# EAGLE design HOST (EAGLE 6.3)
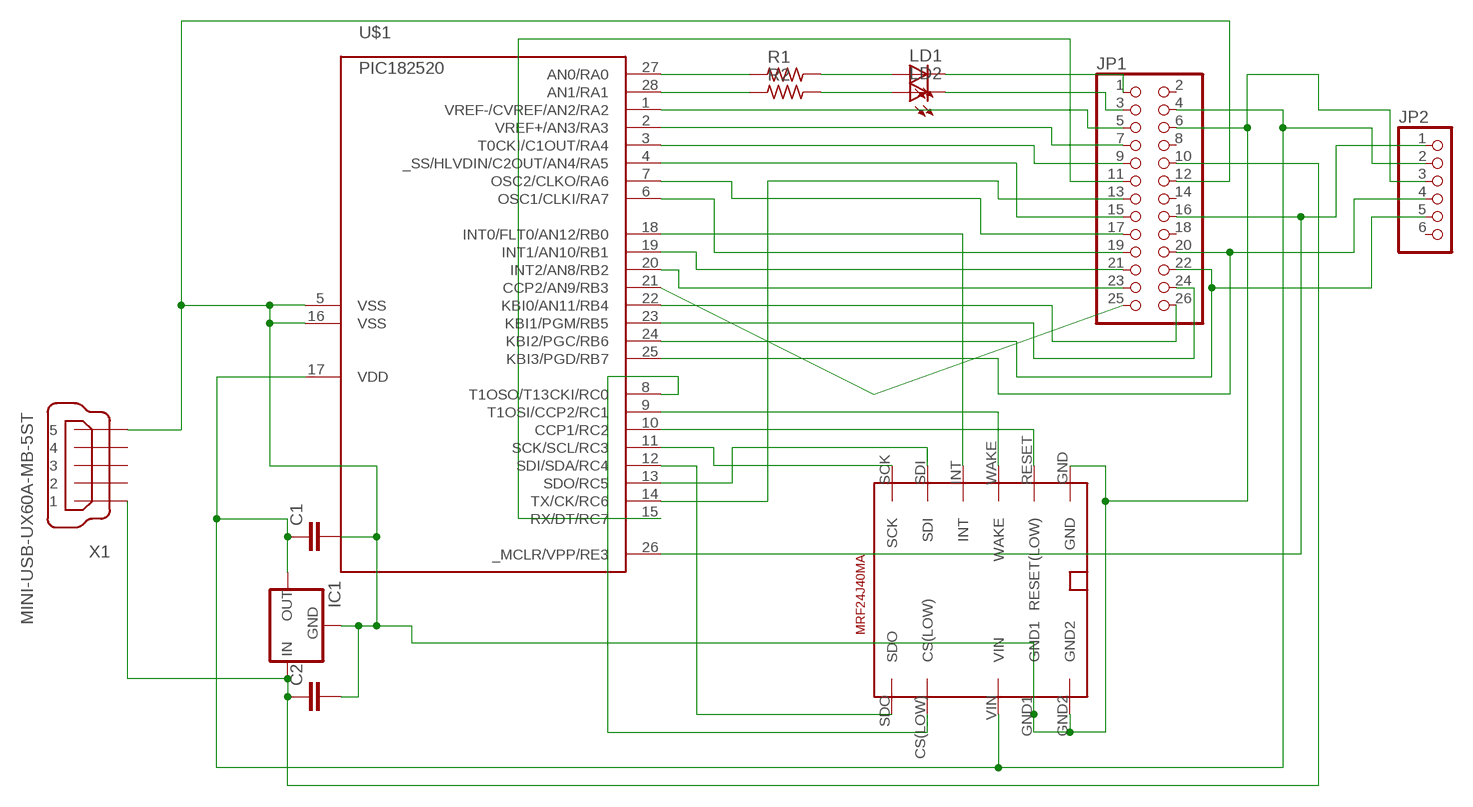
[diagram p0: schematic, sheet 1]

## Parts
C1  C-EUC0805  [C0805]
C2  C-EUC0805  [C0805]
IC1  78LXX-SOT89  [SOT89]
JP1  PINHD-2X13_2.54  [2X13]
JP2  PINHD-1X6  [1X06]
LD1  LEDCHIPLED_0805  [CHIPLED_0805]
LD2  LEDCHIPLED_0805  [CHIPLED_0805]
R1  R_0805  [R0805]
R2  R_0805  [R0805]
U$1  PIC182520  [QFN28]
U$2  MRF24J40MA  [MRF24J40MA]
X1  MINI-USB-UX60A-MB-5ST  [UX60A-MB-5ST]

## Nets
N$1: U$1.12(SDI/SDA/RC4) U$2.SDO
N$2: U$1.8(T1OSO/T13CKI/RC0) U$2.CS(LOW)
N$3: U$1.10(CCP1/RC2) U$2.RESET(RESET(LOW))
N$4: U$1.11(SCK/SCL/RC3) U$2.SCK
N$5: U$1.13(SDO/RC5) U$2.SDI
N$6: U$1.18(INT0/FLT0/AN12/RB0) U$2.INT
N$7: U$1.9(T1OSI/CCP2/RC1) U$2.WAKE
N$9: JP1.13 U$1.14(TX/CK/RC6)
N$10: C1.2 C2.2 IC1.1(GND) JP1.6 JP1.12 JP2.3 U$1.5(VSS) U$1.16(VSS) U$2.GND U$2.GND1 U$2.GND2 X1.5
N$11: JP1.11 U$1.15(RX/DT/RC7)
N$12: C2.1 IC1.2(IN) JP1.10 X1.1
N$14: R1.1 U$1.27(AN0/RA0)
N$15: R2.1 U$1.28(AN1/RA1)
N$16: LD2.A R2.2
N$17: LD1.A R1.2
N$18: JP1.1 LD1.C
N$19: JP1.3 LD2.C
N$20: JP1.5 U$1.1(VREF-/CVREF/AN2/RA2)
N$21: JP1.7 U$1.2(VREF+/AN3/RA3)
N$22: JP1.9 U$1.3(T0CKI/C1OUT/RA4)
N$24: JP1.21 U$1.19(INT1/AN10/RB1)
N$25: JP1.19 U$1.6(OSC1/CLKI/RA7)
N$26: JP1.15 U$1.4(_SS/HLVDIN/C2OUT/AN4/RA5)
N$27: JP1.17 U$1.7(OSC2/CLKO/RA6)
N$28: JP1.23 U$1.20(INT2/AN8/RB2)
N$29: JP1.25 U$1.21(CCP2/AN9/RB3)
N$30: JP1.26 U$1.22(KBI0/AN11/RB4)
N$31: JP1.24 U$1.23(KBI1/PGM/RB5)
N$32: JP1.22 JP2.5 U$1.24(KBI2/PGC/RB6)
N$33: JP1.20 JP2.4 U$1.25(KBI3/PGD/RB7)
N$35: JP1.16 JP2.1 U$1.26(_MCLR/VPP/RE3)
N$36: C1.1 IC1.3(OUT) JP1.4 JP2.2 U$1.17(VDD) U$2.VIN
Unconnected: JP1.2 JP1.8 JP1.14 JP1.18 JP2.6 X1.2 X1.3 X1.4

## Library data of the parts
C1 C2 = rcl 2:C-EU: CAPACITOR, European symbol
IC1 = v-reg-3:78LXX: VOLTAGE REGULATOR
JP1 = pinhead-1:PINHD-2X13: PIN HEADER
JP2 = pinhead 2:PINHD-1X6: PIN HEADER
LD1 LD2 = led 2:LED: LED OSRAM: - CHIPLED LG R971, LG N971, LY N971, LG Q971, LY Q971, LO R971, LY R971 LH N974, LH R974 LS Q976, LO Q976, LY Q976 LO Q996 - Hyper CHIPLED LW Q18S LB Q993, LB Q99A, LB R99A - SideLED LS A670, LO A670, LY A670, LG A670, LP A670 LB A673, LV A673, LT A673, LW A673 LH A674 LY A675 LS A676, LA A676, LO A676, LY A676, LW A676 LS A679, LY A679, LG A679 - Hyper Micro SIDELED® LS Y876, LA Y876, LO Y876, LY Y876 LT Y87S - SmartLED LW L88C, LW L88S LB L89C, LB L89S, LG L890 LS L89K, LO L89K, LY L89K LS L896, LA L896, LO L896, LY L896 - TOPLED LS T670, LO T670, LY T670, LG T670, LP T670 LSG T670, LSP T670, LSY T670, LOP T670, LYG T670 LG T671, LOG T671, LSG T671 LB T673, LV T673, LT T673, LW T673 LH T674 LS T676, LA T676, LO T676, LY T676, LB T676, LH T676, LSB T676, LW T676 LB T67C, LV T67C, LT T67C, LS T67K, LO T67K, LY T67K, LW E67C LS E67B, LA E67B, LO E67B, LY E67B, LB E67C, LV E67C, LT E67C LW T67C LS T679, LY T679, LG T679 LS T770, LO T770, LY T770, LG T770, LP T770 LB T773, LV T773, LT T773, LW T773 LH T774 LS E675, LA E675, LY E675, LS T675 LS T776, LA T776, LO T776, LY T776, LB T776 LHGB T686 LT T68C, LB T68C - Hyper Mini TOPLED® LB M676 - Mini TOPLED Santana® LG M470 LS M47K, LO M47K, LY M47K Source: http://www.osram.convergy.de/
R1 R2 = rc-master:R_: RESISTOR
U$1 = pic18fxx20-2:PIC18*2520: PIC18*2520 Microchip FLASH Microcontroller with A/D DEVICE FEATURES Feature PIC18*2520 Program Memory (bytes) 32768 Program Memory (instructions) 16384 Interupt Sources 19 I/O Ports Ports A, B, C, (E) Capture/Compare/PWM Modules 2 Enhanced Capture/Compare/PWM Modules 0 Parallel Communications (PSP) No 10-bit Analog-to-Digital Module 10 input Channels Package Types 28-pin PDIP 28-pin SOIC 28-pin QFN NOTES: F only after 18, means standard voltage range from 4.2v to 5.5v LF after 18, means extended voltage range from 2.0v to 5.5v -E before / denotes extended temperature range from -40°C to +120°C -I before / denotes industrial temperature range from -40°C to +85°C /PT suffix denotes TQFP package /SO suffix denotes SOIC package /SP suffix denotes Skinny Plastic DIP package /P suffix denotes Plastic DIP package /ML suffix denotes QFN package
U$2 = MRF24J40MA:MRF24J40MA
X1 = con-hirose 2:MINI-USB-: MINI USB Connector Source: http://www.hirose.co.jp/cataloge_hp/e24000019.pdf

## Board
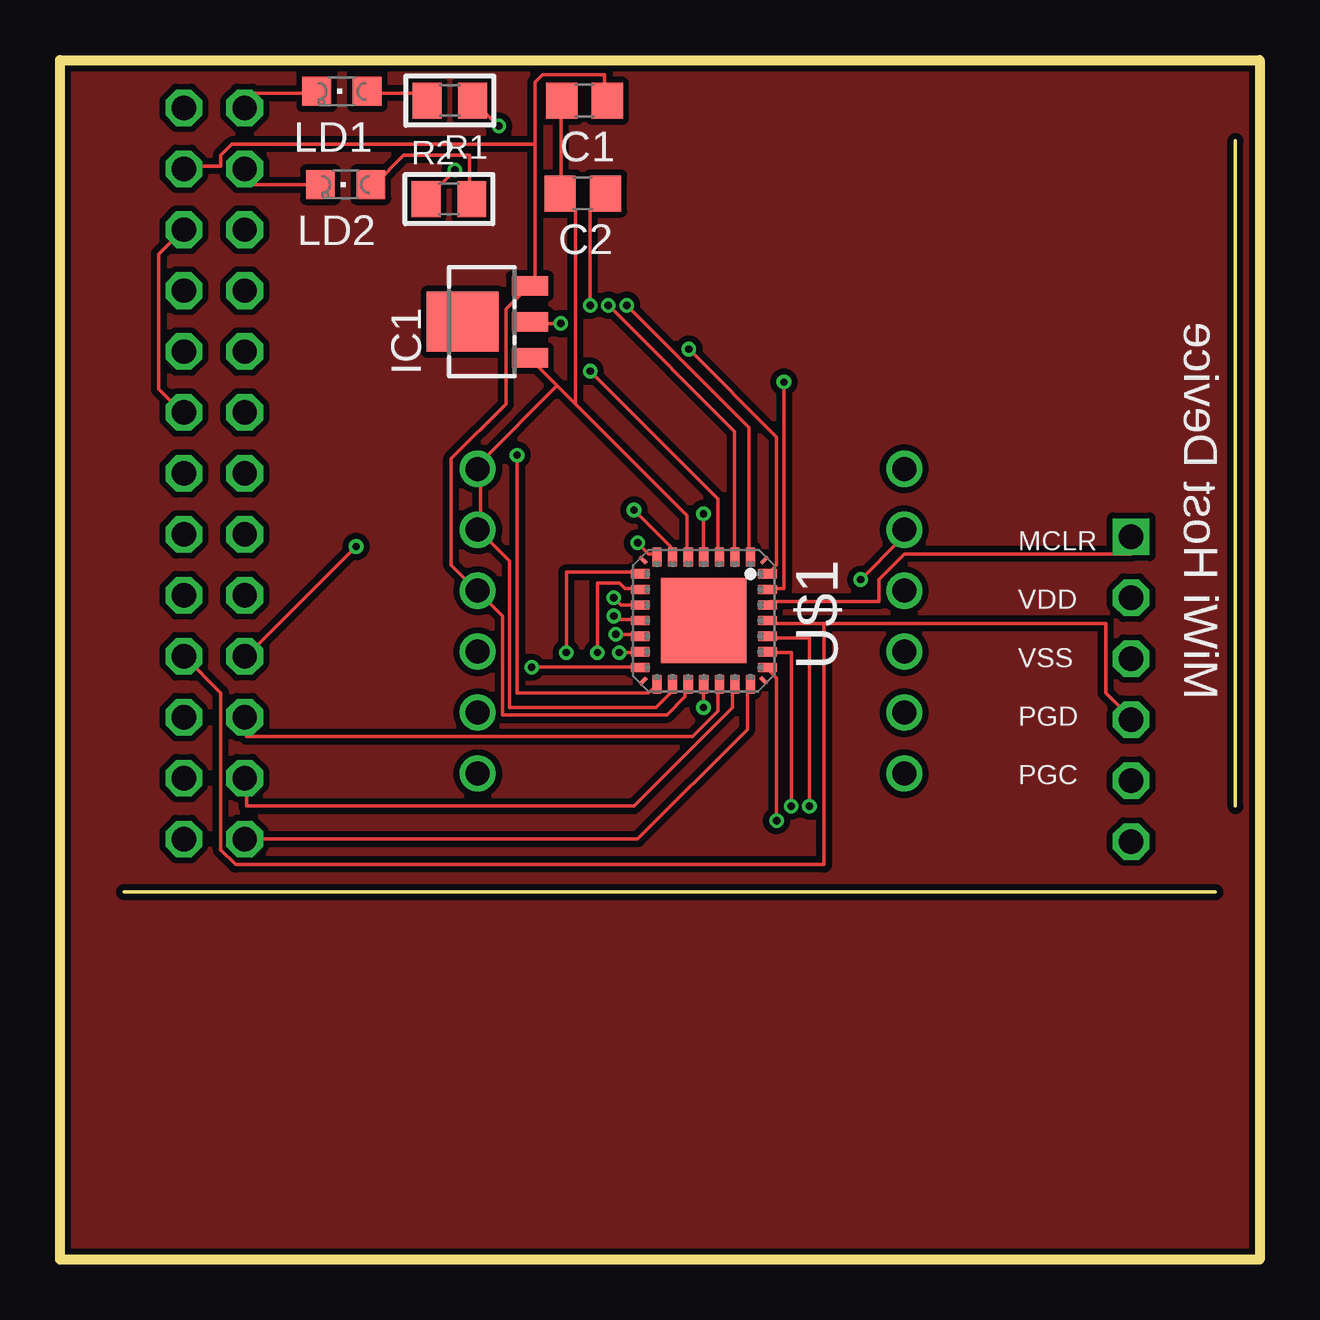
[diagram p1: board, top side]
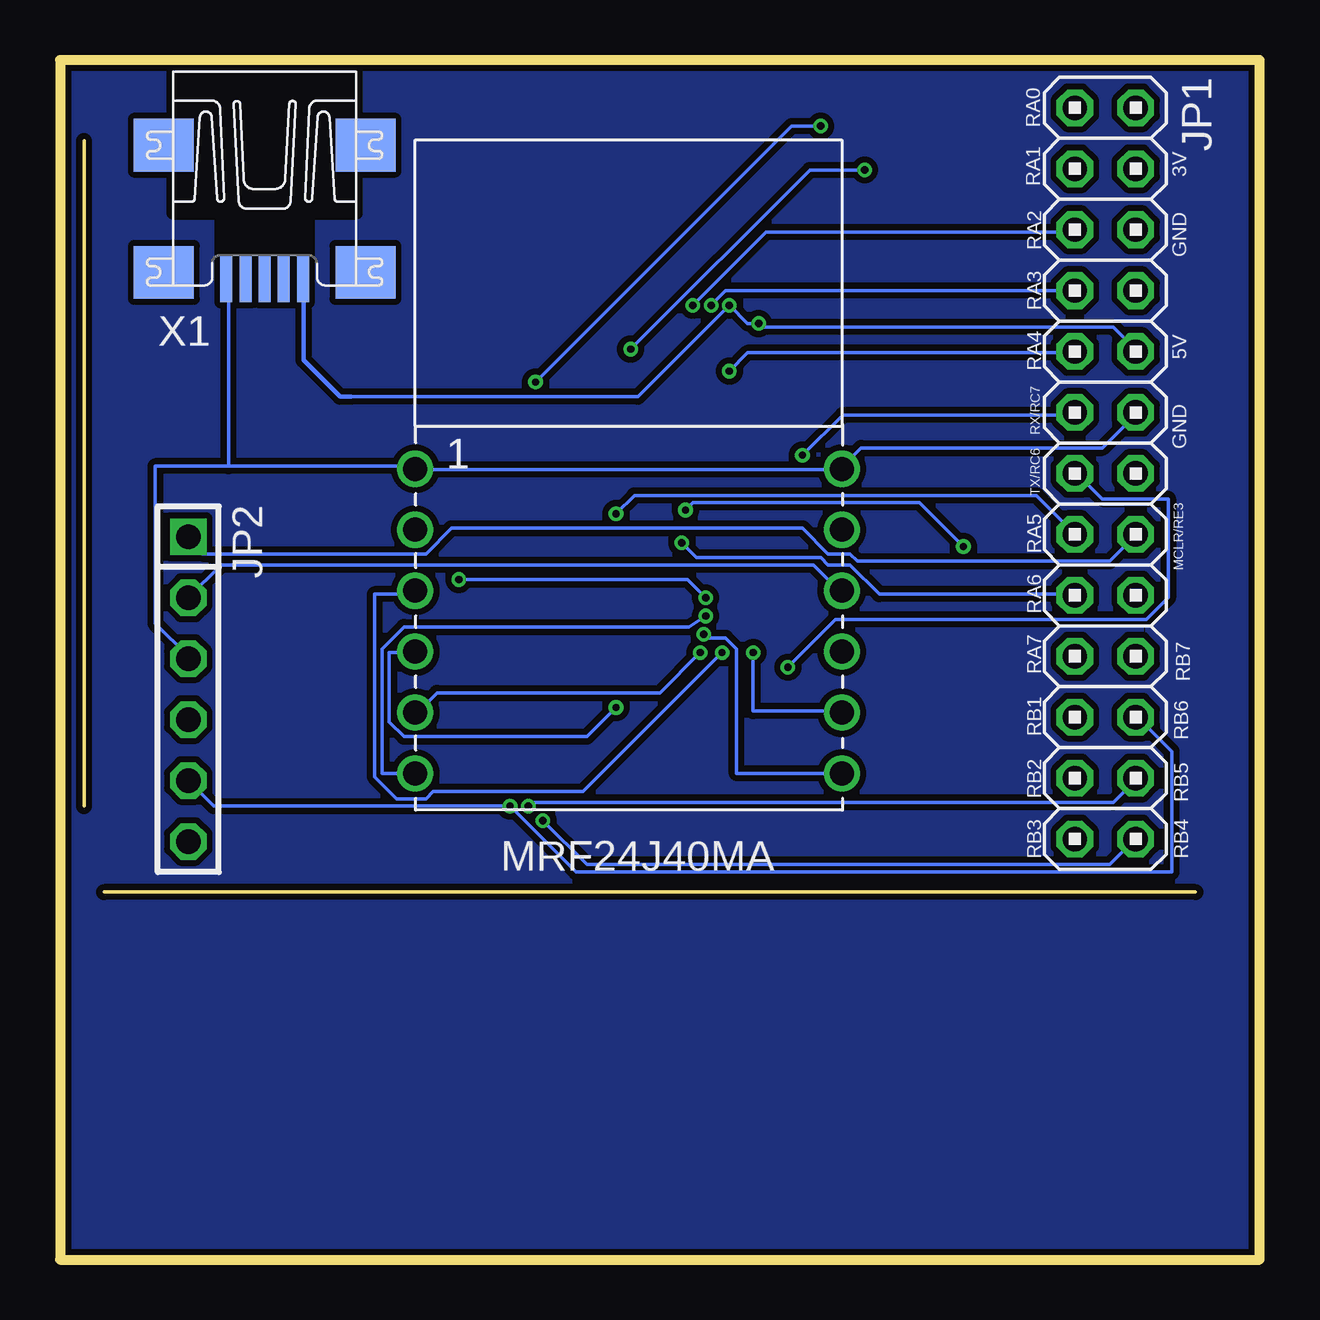
[diagram p2: board, bottom side, seen from below]

Size 50 x 50 mm. Coordinates in mm from the lower left corner, seen from the top.
Outline: 2.67,15.32 48.16,15.32
Outline: 49,18.9 49,46.63
Outline: 0,0 0,50 50,50 50,0 0,0
Copper layers (1*16): Top 0.035mm / dielectric 1.5mm / Bottom 0.035mm
Design rules "ITEADstudio_DRC": minimum track width 6mil, minimum drill 12mil, track to track 6mil, track to pad 6mil, pad to pad 6mil, via to via 6mil, smd to smd 0mil, copper to edge 10mil, drill to drill 10mil, minimum pad ring 10mil, minimum via ring 6mil, stop-mask expansion 2mil, vias tented up to drill 100mil, thermal gap 10mil

### Footprints (pad centres in the part's own frame; a part is rotated, then mirrored left to right if it is on the bottom)
C0805 = smd 1.3 x 1.5: 1 -0.95,0; 2 0.95,0
SOT89 = smd 0.8 x 1.5: 1 -1.5,-1.75; 2 0,-1.75; 3 1.5,-1.75 | smd 2.5 x 3: 4 0,1.05
2X13 = drill 1.016 octagon: 1 -15.24,-1.27; 2 -15.24,1.27; 3 -12.7,-1.27; 4 -12.7,1.27; 5 -10.16,-1.27; 6 -10.16,1.27; 7 -7.62,-1.27; 8 -7.62,1.27; 9 -5.08,-1.27; 10 -5.08,1.27; 11 -2.54,-1.27; 12 -2.54,1.27; 13 0,-1.27; 14 0,1.27; 15 2.54,-1.27; 16 2.54,1.27; 17 5.08,-1.27; 18 5.08,1.27; 19 7.62,-1.27; 20 7.62,1.27; 21 10.16,-1.27; 22 10.16,1.27; 23 12.7,-1.27; 24 12.7,1.27; 25 15.24,-1.27; 26 15.24,1.27
1X06 = drill 1.016 square: 1 -6.35,0 | drill 1.016 octagon: 2 -3.81,0; 3 -1.27,0; 4 1.27,0; 5 3.81,0; 6 6.35,0
CHIPLED_0805 = smd 1.2 x 1.2: A 0,-1.05; C 0,1.05
R0805 = smd 1.2 x 1.5: 1 -0.953,0; 2 0.953,0
QFN28 = smd 0.8 x 0.4: 1 -2.65,1.95; 2 -2.65,1.3; 3 -2.65,0.65; 4 -2.65,0; 5 -2.65,-0.65; 6 -2.65,-1.3; 7 -2.65,-1.95; 15 2.65,-1.95; 16 2.65,-1.3; 17 2.65,-0.65; 18 2.65,0; 19 2.65,0.65; 20 2.65,1.3; 21 2.65,1.95 | smd 0.4 x 0.8: 8 -1.95,-2.65; 9 -1.3,-2.65; 10 -0.65,-2.65; 11 0,-2.65; 12 0.65,-2.65; 13 1.3,-2.65; 14 1.95,-2.65; 22 1.95,2.65; 23 1.3,2.65; 24 0.65,2.65; 25 0,2.65; 26 -0.65,2.65; 27 -1.3,2.65; 28 -1.95,2.65 | smd 3.55 x 3.55: M 0,0 | smd 0.17 x 0.4 rotated 45: R1 -2.525,2.525 | smd 0.17 x 0.4 rotated 135: R2 -2.525,-2.525 | smd 0.17 x 0.4 rotated 225: R3 2.525,-2.525 | smd 0.17 x 0.4 rotated 315: R4 2.5,2.5
MRF24J40MA = drill 1: CS(LOW) 16.764,4.064; GND -1.016,14.224; GND1 16.764,11.684; GND2 16.764,14.224; INT -1.016,6.604; NC 16.764,6.604; RESET -1.016,11.684; SCK -1.016,1.524; SDI -1.016,4.064; SDO 16.764,1.524; VIN 16.764,9.144; WAKE -1.016,9.144
UX60A-MB-5ST = smd 2 x 0.5: 1 2.25,1.6; 2 2.25,0.8; 3 2.25,0; 4 2.25,-0.8; 5 2.25,-1.6 | smd 2.2 x 2.5: M1 -3.3,-4.2; M2 -3.3,4.2; M3 2,4.2; M4 2,-4.2

### Placement (x,y rotation side)
C1  21.86,48.3 180 top
C2  21.79,44.43 180 top
IC1  17.84,39.09 90 top
JP1  6.43,32.77 270 bottom
JP2  44.65,23.77 270 bottom
LD1  11.75,48.69 90 top
LD2  11.91,44.81 90 top
R1  16.25,48.31 180 top
R2  16.21,44.21 0 top
U$1  26.84,26.63 270 top
U$2  34.18,18.73 0 bottom
X1  41.47,43.15 270 bottom

### Tracks (layer width: path | path; a pad name or v marks a point on that pad's centre or on a via)
N$1  (via drill 0.3)
  Top 0.152: v23.16,26.06 24.08,26.06 U$1.12
  Bottom 0.152: v23.16,26.06 23.01,25.91 22.25,25.91 21.79,25.45 21.79,20.27 17.53,20.27 U$2.SDO
N$2  (via drill 0.3)
  Top 0.152: v21.11,25.3 21.11,28.65 24.08,28.65 U$1.8
  Bottom 0.152: v21.11,25.3 21.11,22.86 17.53,22.86 U$2.CS(LOW)
N$3  (via drill 0.3)
  Top 0.152: v23.09,27.58 23.39,27.28 24.16,27.28 U$1.10 | v33.38,28.35 35.05,30.02 35.05,30.33 U$2.RESET
  Bottom 0.152: v23.09,27.58 23.85,28.35 v33.38,28.35
N$4  (via drill 0.3)
  Top 0.152: v23.09,26.82 23.09,26.67 24.08,26.67 U$1.11
  Bottom 0.152: v23.09,26.82 23.77,26.36 35.66,26.36 36.58,25.45 36.58,20.27 35.2,20.27 U$2.SCK
N$5  (via drill 0.3)
  Top 0.152: v23.32,25.3 24.08,25.3 U$1.13
  Bottom 0.152: v23.32,25.3 24.99,23.62 34.29,23.62 35.05,22.86 U$2.SDI
N$6  (via drill 0.3)
  Top 0.152: v26.82,23.01 26.82,23.93 U$1.18
  Bottom 0.152: v26.82,23.01 28.04,21.79 35.66,21.79 36.27,22.4 36.27,25.3 35.2,25.3 U$2.INT
N$7  (via drill 0.3)
  Top 0.152: v22.4,25.3 22.4,28.19 23.32,28.19 23.55,27.96 24.16,27.96 U$1.9
  Bottom 0.152: v22.4,25.3 28.19,19.51 34.44,19.51 34.75,19.2 35.97,19.2 36.88,20.12 36.88,27.74 35.2,27.74 U$2.WAKE
N$8
  pour Top (isolate 0.254): 0,50 50,50 50,0 0,0
N$9  (via drill 0.3)
  Top 0.152: v19.66,24.69 24.08,24.69 U$1.14
  Bottom 0.152: v19.66,24.69 17.68,26.67 4.72,26.67 3.81,27.58 3.81,31.7 6.55,31.7 7.62,32.77 JP1.13
N$10
  Top 0.152: 20.73,36.42 19.66,37.49 IC1.1 | 20.73,36.42 21.49,35.66 | 21.49,35.66 26.14,31.01 26.14,29.41 U$1.5 | 21.49,35.66 21.49,43.74 20.88,44.35 C2.2 20.88,44.5 20.88,48.16 C1.2 | U$1.16 25.45,23.93 25.45,23.62 24.84,23.01 18.75,23.01 18.75,29.11 17.53,30.33 U$2.GND1 17.53,30.48 17.53,32.92 U$2.GND2 17.53,33.07 17.53,33.22 20.73,36.42 | JP1.12 5.03,35.36 4.12,36.27 4.12,41.91 5.03,42.82 JP1.6
  Bottom 0.152: 42.98,33.07 42.98,40.84 X1.5 | 42.98,33.07 35.2,33.07 U$2.GND 35.05,32.92 17.53,32.92 U$2.GND2 17.37,33.07 16.61,33.83 6.55,33.83 5.18,35.2 JP1.12 | 42.98,33.07 46.02,33.07 46.02,26.52 44.65,25.15 JP2.3
N$11  (via drill 0.3)
  Top 0.152: v19.05,33.53 19.05,23.62 24.54,23.62 24.84,23.93 U$1.15
  Bottom 0.152: v19.05,33.53 17.37,35.2 7.77,35.2 JP1.11
N$12  (via drill 0.3)
  Top 0.152: v20.88,39.01 19.66,39.01 IC1.2 | v22.1,39.78 22.1,43.74 22.71,44.35 C2.1
  Bottom 0.152: JP1.10 5.18,37.95 6.1,38.86 20.73,38.86 v20.88,39.01 21.34,39.01 v22.1,39.78 25.91,35.97 37.87,35.97 | 39.78,40.84 X1.1
  Bottom 0.178: 37.87,35.97 38.33,35.97 39.85,37.49 39.85,40.88 X1.1
N$13
  pour Bottom (isolate 0.254): 0,50 50,50 50,0 0,0
N$14  (via drill 0.3)
  Top 0.152: v30.18,36.58 30.18,27.96 29.57,27.96 U$1.27 | v18.29,47.24 17.22,48.31 R1.1
  Bottom 0.152: v30.18,36.58 19.51,47.24 v18.29,47.24
N$15  (via drill 0.3)
  Top 0.152: v26.21,37.95 29.87,34.29 29.87,28.96 29.57,28.65 U$1.28 | v16.46,45.41 15.39,44.35 R2.1
  Bottom 0.152: v26.21,37.95 18.75,45.41 v16.46,45.41
N$16
  Top 0.152: LD2.A 13.11,44.81 14.33,46.02 17.07,46.02 17.07,44.35 R2.2
N$17
  Top 0.152: LD1.A 12.95,48.62 15.24,48.62 15.24,48.31 R1.2
N$18
  Top 0.152: LD1.C 10.67,48.62 7.77,48.62 7.77,48.01 JP1.1
N$19
  Top 0.152: LD2.C 7.77,44.81 7.77,45.41 JP1.3
N$20  (via drill 0.3)
  Top 0.152: v23.62,39.78 28.73,34.67 28.73,29.41 U$1.1
  Bottom 0.152: v23.62,39.78 20.57,42.82 7.77,42.82 JP1.5
N$21  (via drill 0.3)
  Top 0.152: v22.86,39.78 28.12,34.52 28.12,29.41 U$1.2
  Bottom 0.152: v22.86,39.78 22.25,40.39 JP1.7
N$22  (via drill 0.3)
  Top 0.152: v22.1,37.03 27.43,31.7 27.43,29.41 U$1.3
  Bottom 0.152: v22.1,37.03 21.34,37.8 7.77,37.8 JP1.9
N$24
  Top 0.152: U$1.19 27.43,23.93 27.43,22.86 26.36,21.79 7.77,21.79 7.77,22.55 JP1.21
N$25  (via drill 0.3)
  Top 0.152: v23.93,31.24 25.45,29.72 25.45,29.41 U$1.6 | v12.34,29.72 7.77,25.15 JP1.19
  Bottom 0.152: v23.93,31.24 23.62,31.55 14.17,31.55 v12.34,29.72
N$26  (via drill 0.3)
  Top 0.152: v26.82,31.09 26.82,29.41 U$1.4
  Bottom 0.152: v26.82,31.09 26.06,31.85 9.3,31.85 7.77,30.33 JP1.15
N$27  (via drill 0.3)
  Top 0.152: v24.08,29.87 24.54,29.41 24.84,29.41 U$1.7
  Bottom 0.152: v24.08,29.87 23.47,29.26 18.29,29.26 17.98,28.96 17.07,28.96 15.85,27.74 7.77,27.74 JP1.17
N$28
  Top 0.152: U$1.20 28.04,23.93 28.04,23.01 23.93,18.9 7.77,18.9 7.77,19.96 JP1.23
N$29
  Top 0.152: JP1.25 24.08,17.53 28.65,22.1 28.65,23.93 U$1.21
N$30  (via drill 0.3)
  Top 0.152: v29.87,18.29 29.87,24.23 29.57,24.54 U$1.22
  Bottom 0.152: v29.87,18.29 28.04,16.46 6.25,16.46 5.18,17.53 JP1.26
N$31  (via drill 0.3)
  Top 0.152: v30.48,18.9 30.48,25.3 29.57,25.3 U$1.23
  Bottom 0.152: v30.48,18.9 30.33,19.05 6.1,19.05 5.18,19.96 JP1.24
N$32  (via drill 0.3)
  Top 0.152: v31.24,18.9 31.24,25.91 29.57,25.91 U$1.24
  Bottom 0.152: JP2.5 43.59,18.9 v31.24,18.9 28.5,16.15 3.66,16.15 3.66,21.18 5.03,22.55 JP1.22
N$33
  Top 0.152: 31.85,26.52 43.59,26.52 43.59,23.62 44.65,22.55 JP2.4 | 31.85,26.52 29.57,26.52 U$1.25 | 31.85,26.52 31.85,16.46 7.32,16.46 6.71,17.07 6.71,23.62 5.18,25.15 JP1.20
N$35
  Top 0.152: JP2.1 44.65,29.41 35.2,29.41 34.14,28.35 34.14,27.43 29.57,27.43 U$1.26
  Bottom 0.152: JP1.16 5.18,30.18 6.25,29.11 16.76,29.11 17.07,29.41 17.98,29.41 19.05,30.48 33.68,30.48 34.75,29.41 44.04,29.41 44.65,30.02 JP2.1
N$36
  Top 0.152: 19.81,46.48 19.81,49.07 20.12,49.38 22.71,49.38 22.71,48.31 C1.1 | 19.81,46.48 19.81,40.84 19.66,40.69 IC1.3 19.51,40.54 18.59,39.62 18.59,35.66 16.31,33.38 16.31,28.96 17.37,27.89 U$2.VIN 17.53,27.74 18.44,26.82 18.44,22.71 25.3,22.71 26.06,23.47 26.06,23.93 U$1.17 | 19.81,46.48 7.16,46.48 6.71,46.02 6.71,45.57 5.18,45.57 JP1.4
  Bottom 0.152: JP2.2 43.28,28.96 18.59,28.96 17.53,27.89 U$2.VIN

### Text on the board
tPlace: MiWi Host Device | MCLR / / VDD / / VSS / / PGD / / PGC
bPlace: RA0 | 3V | RA1 | GND | RA2 | RA3 | 5V | RA4 | GND | RX/RC7 | TX/RC6 | MCLR/RE3 | RA5 | RA6 | RB7 | RA7 | RB6 | RB1 | RB5 | RB2 | RB4 | RB3